# Altium schematic sheet Meranie.SchDoc
size A
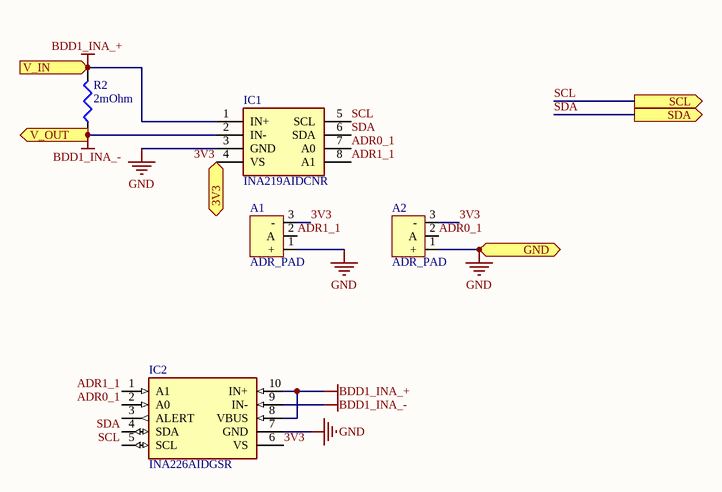
[diagram p0: Meranie.SchDoc]

## Parts
A1  ADR_PAD  [SOLDER_PAD]
A2  ADR_PAD  [SOLDER_PAD]
IC1  INA219AIDCNR  [SOT65P280X145-8N]
IC2  INA226AIDGSR  [SOP50P490X110-10N]
R2  2mOhm  [RESC3216X75N]

## Ports
3V3 (bidir), GND (bidir), SCL (out), SDA (out), V_IN (in), V_OUT (out)

## Nets
BDD1_INA_+: IC1.1(IN+) IC2.8(VBUS) IC2.10(IN+) R2.2 ; port V_IN
BDD1_INA_-: IC1.2(IN-) IC2.9(IN-) R2.1 ; port V_OUT
GND: A1.1(+) A2.1(+) IC1.3(GND) IC2.7(GND) ; port GND
3V3: A1.3(-) A2.3(-) IC1.4(VS) IC2.6(VS) ; port 3V3
ADR0_1: A2.2(A) IC1.7(A0) IC2.2(A0)
ADR1_1: A1.2(A) IC1.8(A1) IC2.1(A1)
SCL: IC1.5(SCL) IC2.5(SCL) ; port SCL
SDA: IC1.6(SDA) IC2.4(SDA) ; port SDA

Not connected (* = marked no-connect by the designer): IC2 3(ALERT)

## Library data of the parts
A1 A2 = ADR_PAD: ADR PAD 3 PIN
IC1 = INA219BIDCNR: Integrated Circuit; Manufacturer_Name: Texas Instruments; Datasheet Link: http://www.ti.com/lit/ds/symlink/ina219.pdf; Height: 1.45mm; Manufacturer_Part_Number: INA219BIDCNR; Mouser Part Number: 595-INA219BIDCNR; Mouser Price/Stock: https://www.mouser.com/Search/Refine.aspx?Keyword=595-INA219BIDCNR
IC2 = INA226AIDGSR: Integrated Circuit; Manufacturer_Name: Texas Instruments; Datasheet Link: https://componentsearchengine.com/Datasheets/1/INA226AIDGSR.pdf; Height: 1.1mm; Manufacturer_Part_Number: INA226AIDGSR; Arrow Part Number: INA226AIDGSR; Arrow Price/Stock: https://www.arrow.com/en/products/ina226aidgsr/texas-instruments; Mouser Part Number: 595-INA226AIDGSR; Mouser Price/Stock: https://www.mouser.co.uk/ProductDetail/Texas-Instruments/INA226AIDGSR?qs=tQG3bEuiOZD4quG3egR36g%3D%3D
R2 = Res3: Resistor; Published: 8-Jun-2000; LatestRevisionDate: 29-May-2009; LatestRevisionNote: IPC-7351 Footprint Added.; PackageReference: J1-0603; Publisher: Altium Limited; PackageDescription: Chip Resistor; Value: 2mOhm